# Altium schematic sheet power.SchDoc
size A3; DocumentNumber: 2; Revision: V1.0; SheetNumber: 2; SheetTotal: 9; Rule: PcbType=ProtelPcb
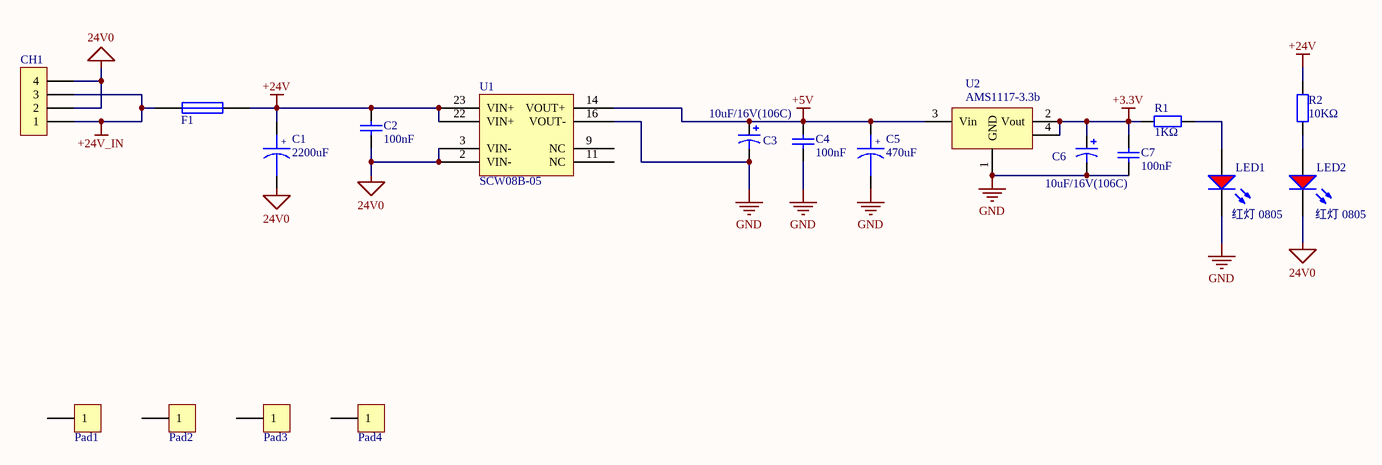
[diagram p0: power.SchDoc]

## Parts
C1  value 2200uF  [C7.8*17]  (hidden comment: C_2200uF)
C2  100nF  [0805_C]
C3  value 10uF/16V(106C)  [CAP A-3216]  (hidden comment: Cap Pol3b)
C4  100nF  [0805_C]
C5  value 470uF  [C5*10]  (hidden comment: C_2200uF)
C6  value 10uF/16V(106C)  [CAP A-3216]  (hidden comment: Cap Pol3b)
C7  100nF  [0805_C]
CH1  HEADER1X4  [CH3.96-4PIN]  (value not drawn)
F1  FUSE  [X30UF900]  (value not drawn)
LED1  红灯 0805  [0805_LED_S1]
LED2  红灯 0805  [0805_LED_S1]
Pad1  Pad  [pad35]  (value not drawn)
Pad2  Pad  [pad35]  (value not drawn)
Pad3  Pad  [pad35]  (value not drawn)
Pad4  Pad  [pad35]  (value not drawn)
R1  1KΩ  [0805_R]
R2  10KΩ  [0805_R]
U1  SCW08B-05  [SCW08B-05]
U2  AMS1117-3.3b  [SOT223]

## Nets
24V0: C1.2 C2.1 CH1.2 CH1.4 LED2.K U1.2(VIN-) U1.3(VIN-)
+3.3V: C6.1 C7.2 R1.1 U2.2(Vout) U2.4
+5V: C3.1 C4.2 C5.1 U1.14(VOUT+) U2.3(Vin)
+24V: C1.1 C2.2 F1.2 R2.2 U1.22(VIN+) U1.23(VIN+)
+24V_IN: CH1.1 CH1.3 F1.1
GND: C3.2 C4.1 C5.2 C6.2 C7.1 LED1.K U1.16(VOUT-) U2.1(GND)
NetLED1_A: LED1.A R1.2
NetLED2_A: LED2.A R2.1

Not connected (* = marked no-connect by the designer): Pad1 1; Pad2 1; Pad3 1; Pad4 1; U1 9(NC) 11(NC)

## Notes on the sheet
- :
- (in symbol C_2200uF) +

## Library data of the parts
C2 C4 C7 = 0805 100nF(104) 10% 50V: 贴片电容; ComponentLink1Description: 供应商链接; ComponentLink1URL: http://www.szlcsc.com/product/details_50686.html; Package: 0805; Supplier: LC; SuppliersPartNumber: C49678
C3 C6 = Cap Pol3: Polarized Capacitor (Surface Mount); Published: 8-Jun-2000; LatestRevisionDate: 17-Jul-2002; LatestRevisionNote: Re-released for DXP Platform.; PackageReference: C0805; Publisher: Altium Limited
LED1 LED2 = 0805 红灯: 发光二极管; ComponentLink1Description: 供应商链接; ComponentLink1URL: http://www.szlcsc.com/product/details_2668.html; Package: 0805; Supplier: LC; SuppliersPartNumber: C2295
R1 R2 = 0805 11KΩ (1102) 1%: 贴片电阻; ComponentLink1Description: 供应商链接; ComponentLink1URL: http://www.szlcsc.com/product/details_18117.html; Package: 0805; Supplier: LC; SuppliersPartNumber: C17429
U2 = AMS1117-5